# EAGLE schematic camera_sub_module (EAGLE 7.6.0)
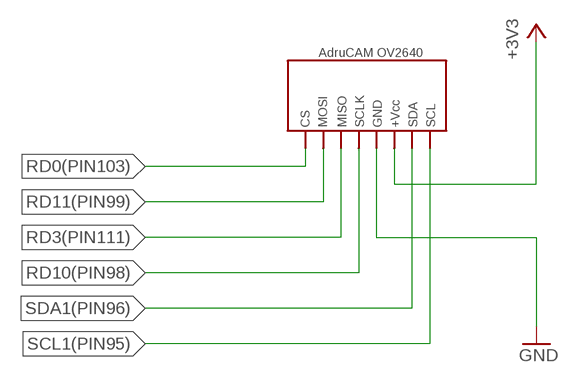
[diagram p0: schematic, sheet 1]

## Parts
U$1  MOTOR  [MOTOR]

## Library data of the parts
U$1 = ArduCAM_OV2640:MOTOR